# EAGLE design Board Schematic1 (EAGLE 9.6.2)
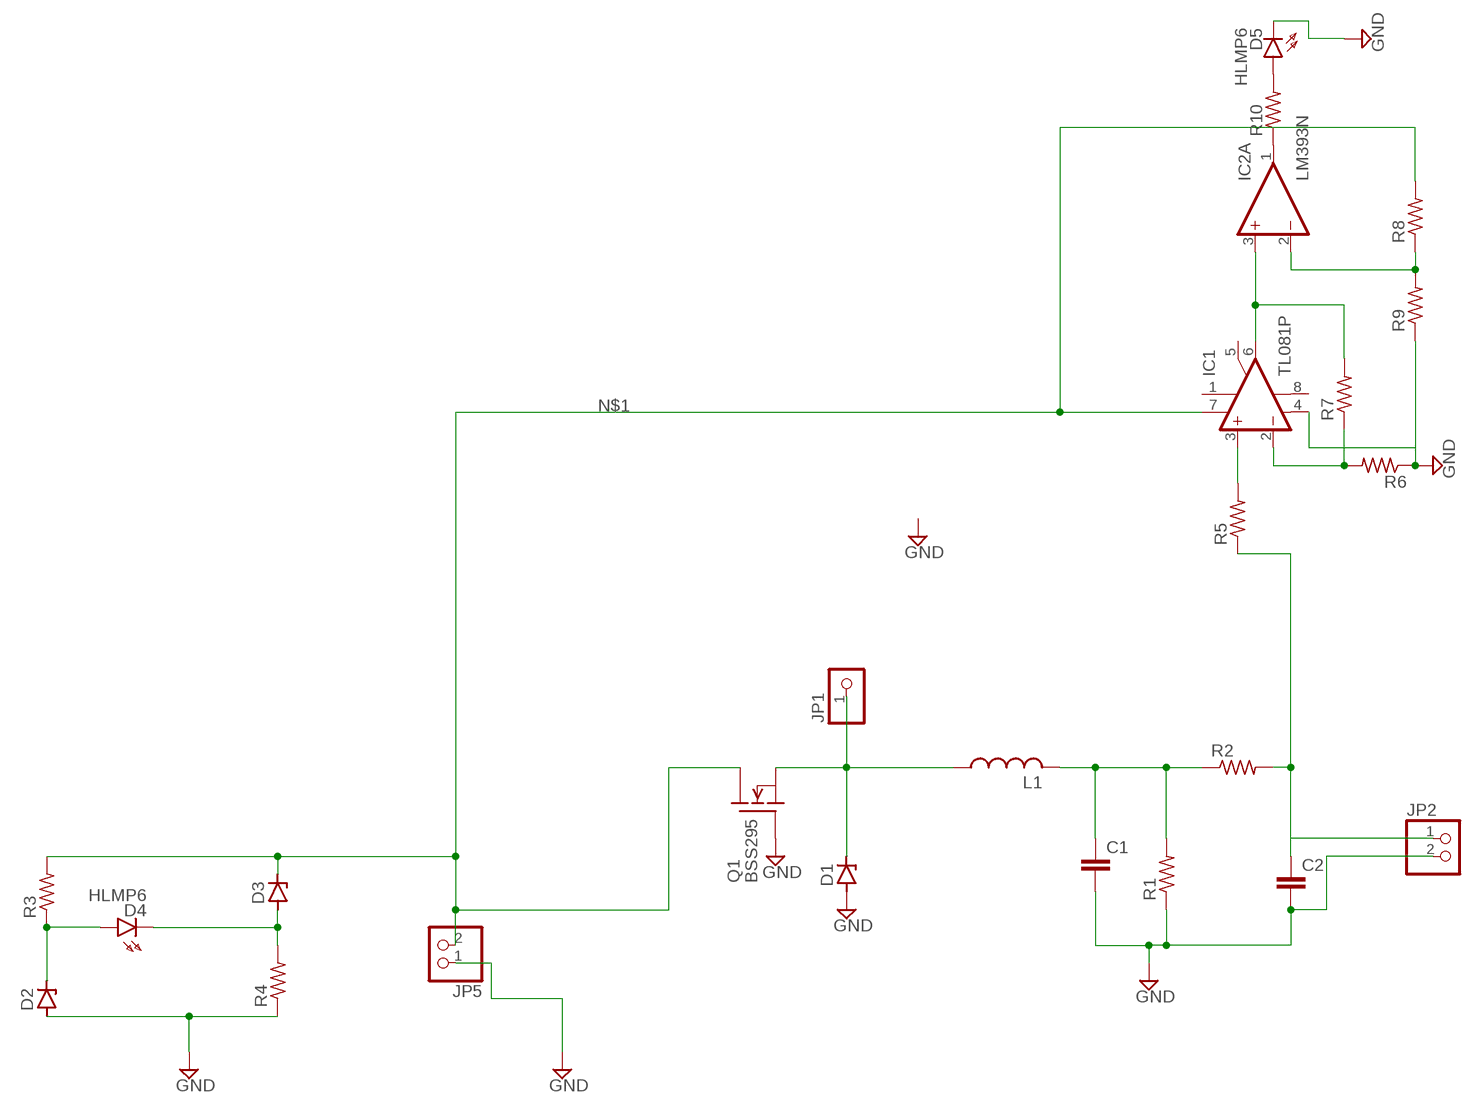
[diagram p0: schematic, sheet 1]

## Parts
C1  C-EU025-025X050  [C025-025X050]
C2  C-EU025-025X050  [C025-025X050]
D1  ZENER-DIODEDO35Z10  [DO35Z10]
D2  ZENER-DIODEDO35Z10  [DO35Z10]
D3  ZENER-DIODEDO35Z10  [DO35Z10]
D4  HLMP6  [HLMP6]
D5  HLMP6  [HLMP6]
IC1  TL081P  [DIL08]
IC2  LM393N  [DIL08]
JP1  PINHD-1X1  [1X01]
JP2  PINHD-1X2  [1X02]
JP5  PINHD-1X2  [1X02]
L1  L-US6000-XXX-RC  [6000-XXXX-RC]
Q1  BSS295  [TO92]
R1  R-US_0204/7  [0204/7]
R2  R-US_0204/7  [0204/7]
R3  R-US_0204/7  [0204/7]
R4  R-US_0204/7  [0204/7]
R5  R-US_0204/7  [0204/7]
R6  R-US_0204/7  [0204/7]
R7  R-US_0204/7  [0204/7]
R8  R-US_0204/7  [0204/7]
R9  R-US_0204/7  [0204/7]
R10  R-US_0204/7  [0204/7]

## Nets
GND: C1.2 C2.2 D1.A D2.A D5.K IC1.4(V-) JP2.2 JP5.1 Q1.1(G) R1.1 R4.1 R6.1 R9.1
N$1: D3.C IC1.7(V+) JP5.2 Q1.2(D) R3.2 R8.2
N$2: D1.C JP1.1 L1.1 Q1.3(S)
N$3: C1.1 L1.2 R1.2 R2.1
N$4: C2.1 JP2.1 R2.2 R5.1
N$5: IC1.3(+IN) R5.2
N$6: D2.C D4.A R3.1
N$7: D3.A D4.K R4.2
N$8: IC1.2(-IN) R6.2 R7.1
N$9: IC1.6(OUT) IC2.3(A:+IN) R7.2
N$10: IC2.2(A:-IN) R8.1 R9.2
N$11: D5.A R10.2
N$12: IC2.1(A:OUT) R10.1
Unconnected: IC1.1(ON1) IC1.5(ON2) IC1.8(OPT) IC2.5(B:+IN) IC2.6(B:-IN) IC2.7(B:OUT)

## Power pins joined to a net without a drawn wire
V+: IC2.8(P:V+)
V-: IC2.4(P:V-)

## Library data of the parts
C1 C2 = rcl:C-EU: CAPACITOR, European symbol; SPICEPREFIX: C
D1-D3 = diode:ZENER-DIODE: Z-Diode
D4 D5 = display-hp:HLMP6: LED 2mm horizontal; MF: AGILENT TECHNOLOGIES; MPN: HLMP-6500; OC_FARNELL: 1652490; OC_NEWARK: 40K0088
IC1 = linear:TL081: OP AMP
IC2 = linear:LM393: COMPARATOR
JP1 = pinhead:PINHD-1X1: PIN HEADER
JP2 JP5 = pinhead:PINHD-1X2: PIN HEADER
L1 = rcl:L-US: INDUCTOR, American symbol; SPICEPREFIX: L
Q1 = transistor-fet:BSS295: N-Channel Enhancement MOSFET not checked
R1-R10 = rcl:R-US_: RESISTOR, American symbol; SPICEPREFIX: R

## Board
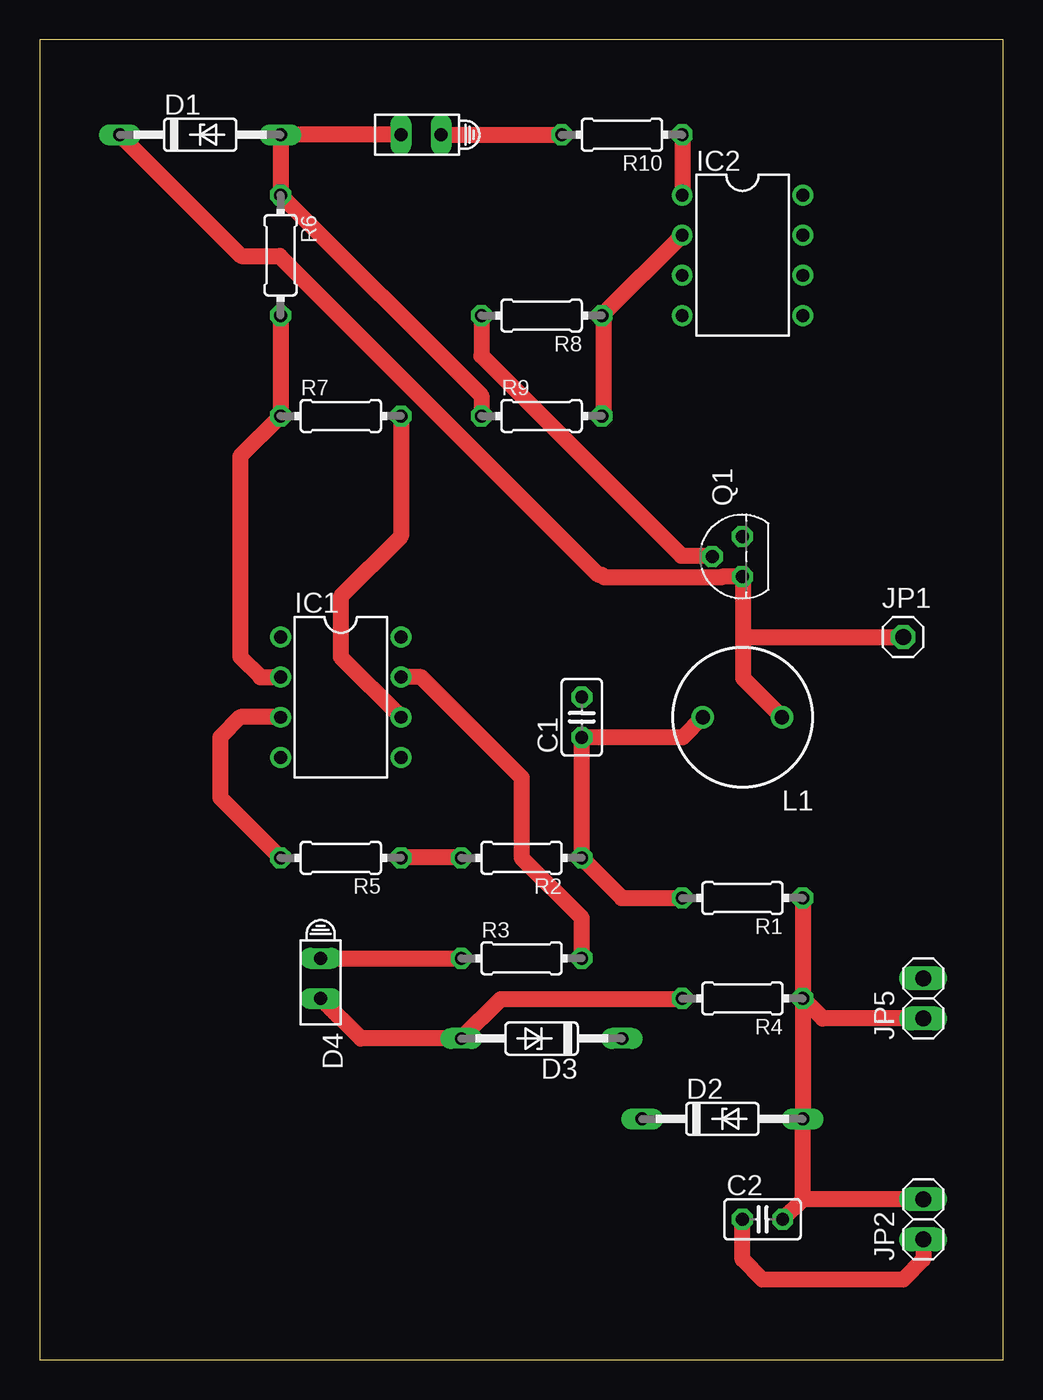
[diagram p1: board, top side]
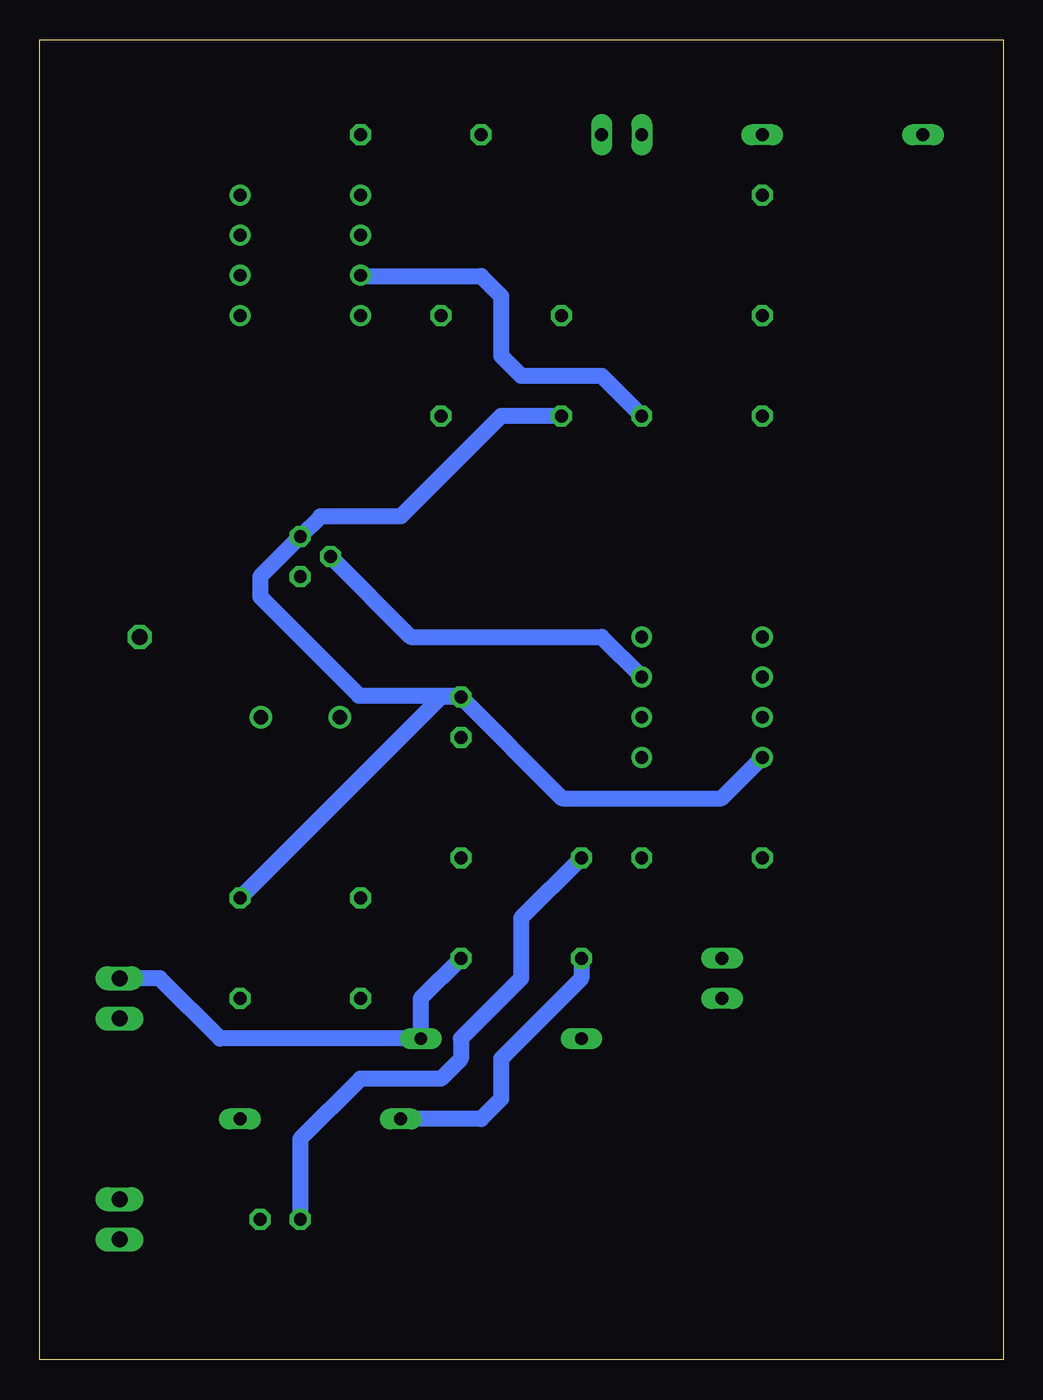
[diagram p2: board, bottom side, seen from below]

Size 60.94 x 83.49 mm. Coordinates in mm from the lower left corner, seen from the top.
Outline: 0,0 60.94,0 60.94,83.49 0,83.49 0,0
Copper layers (1*16): Top 0.035mm / dielectric 1.5mm / Bottom 0.035mm
Design rules "default": minimum track width 6mil, minimum drill 0.35mm, track to track 6mil, track to pad 6mil, pad to pad 6mil, via to via 6mil, smd to smd 6mil, copper to edge 40mil, drill to drill 6mil, minimum pad ring 10mil, minimum via ring 8mil, stop-mask expansion 4mil, vias tented up to drill 0mil, thermal gap 10mil

### Footprints (pad centres in the part's own frame; a part is rotated, then mirrored left to right if it is on the bottom)
C025-025X050 = drill 0.813 octagon: 1 -1.27,0; 2 1.27,0
DO35Z10 = drill 0.813 long: A 5.08,0; C -5.08,0
HLMP6 = drill 0.813 long: A -1.27,0; K 1.27,0
DIL08 = drill 0.813 pad 1.27: 1 -3.81,-3.81; 2 -1.27,-3.81; 3 1.27,-3.81; 4 3.81,-3.81; 5 3.81,3.81; 6 1.27,3.81; 7 -1.27,3.81; 8 -3.81,3.81
1X01 = drill 1.016 octagon: 1 0,0
1X02 = drill 1.016 long: 1 -1.27,0; 2 1.27,0
6000-XXXX-RC = drill 0.9 pad 1.422: 1 -2.5,0; 2 2.5,0
TO92 = drill 0.813 octagon: 1 1.27,0; 2 0,1.905; 3 -1.27,0
0204/7 = drill 0.813 octagon: 1 -3.81,0; 2 3.81,0

### Placement (x,y rotation side)
C1  34.29,40.64 90 top
C2  45.72,8.89 0 top
D1  10.16,77.47 0 top
D2  43.18,15.24 0 top
D3  31.75,20.32 180 top
D4  17.78,24.13 270 top
D5  24.13,77.47 180 top
IC1  19.05,41.91 270 top
IC2  44.45,69.85 270 top
JP1  54.61,45.72 0 top
JP2  55.88,8.89 90 top
JP5  55.88,22.86 90 top
L1  44.45,40.64 180 top
Q1  44.45,50.8 90 top
R1  44.45,29.21 180 top
R2  30.48,31.75 180 top
R3  30.48,25.4 0 top
R4  44.45,22.86 180 top
R5  19.05,31.75 180 top
R6  15.24,69.85 270 top
R7  19.05,59.69 0 top
R8  31.75,66.04 180 top
R9  31.75,59.69 0 top
R10  36.83,77.47 180 top

### Tracks (layer width: path | path; a pad name or v marks a point on that pad's centre or on a via)
GND
  Top 1.016: D5.K D1.A R6.1 27.94,60.96 R9.1 | R1.1 R4.1 | JP5.1 49.53,21.59 R4.1 | R4.1 D2.A 48.26,10.16 | JP2.2 48.26,10.16 | 48.26,10.16 C2.2
  Bottom 0.152: C1.2 34.29,42.01 35.05,42.01 35.2,42.16 48.16,29.21 R1.1
  Bottom 1.016: R9.1 31.75,59.69 38.1,53.34 43.18,53.34 Q1.1 46.99,49.53 46.99,48.26 40.74,42.01 34.29,42.01 | R1.1 35.56,41.91 C1.2 27.89,35.51 17.83,35.51 IC1.4
N$1
  Top 0.152: 42.52,50.85 Q1.2
  Top 1.016: R3.2 34.29,27.94 30.48,31.75 30.48,36.83 24.13,43.18 IC1.7 | R8.2 27.94,63.5 40.59,50.85 42.52,50.85
  Bottom 1.016: Q1.2 37.47,45.72 25.4,45.72 IC1.7 | JP5.2 53.34,24.13 49.53,20.32 D3.C 36.83,22.86 R3.2
N$2
  Top 0.152: 44.5,45.67 44.5,43.08 46.94,40.64 L1.1 | 44.5,49.48 Q1.3 | 35.56,49.63 35.36,49.63 | JP1.1 54.56,45.67
  Top 1.016: D1.C 12.75,69.8 15.19,69.8 35.36,49.63 | Q1.3 43.14,49.53 43.09,49.48 35.71,49.48 35.56,49.63 | L1.1 44.5,43.09 44.5,45.67 | 44.5,45.67 44.5,49.48 | 54.56,45.67 44.5,45.67
N$3
  Top 1.016: R1.2 36.83,29.21 R2.1 C1.1 40.68,39.37 L1.2
N$4
  Top 0.152: 26.67,31.8 R2.2
  Top 1.016: R5.1 22.91,31.8 26.67,31.8 | JP2.1 55.88,6.35 54.61,5.08 45.72,5.08 44.45,6.35 C2.1
  Bottom 1.016: R2.2 30.48,27.94 30.48,24.13 34.29,20.32 34.29,19.05 35.56,17.78 40.64,17.78 44.45,13.97 C2.1
N$5
  Top 1.016: IC1.3 12.7,40.64 11.43,39.37 11.43,35.56 R5.2
N$6
  Top 1.016: D4.A R3.1
  Bottom 1.016: R3.1 26.67,24.13 31.75,19.05 31.75,16.51 33.02,15.24 D2.C
N$7
  Top 0.152: 26.67,20.37 20.27,20.37 D4.K | 29.21,22.81 29.11,22.81 26.67,20.37 | 26.67,20.37 D3.A
  Top 1.016: D4.K 20.32,20.32 D3.A 29.16,22.81 29.21,22.81 40.59,22.81 R4.2
N$8
  Top 1.016: R6.2 R7.1 12.7,57.15 12.7,44.45 13.97,43.18 IC1.2
N$9
  Top 1.016: R7.2 22.86,52.07 19.05,48.26 19.05,44.45 IC1.6
  Bottom 1.016: IC2.3 40.59,68.53 33.02,68.53 31.75,67.26 31.75,63.5 30.48,62.23 25.4,62.23 R7.2
N$10
  Top 0.152: 35.66,59.69 R9.2 | 35.51,66.09 R8.1
  Top 1.016: IC2.2 35.61,66.09 35.51,66.09 | R8.1 35.66,65.94 35.66,59.69
N$11
  Top 1.016: D5.A R10.2
N$12
  Top 1.016: R10.1 IC2.1